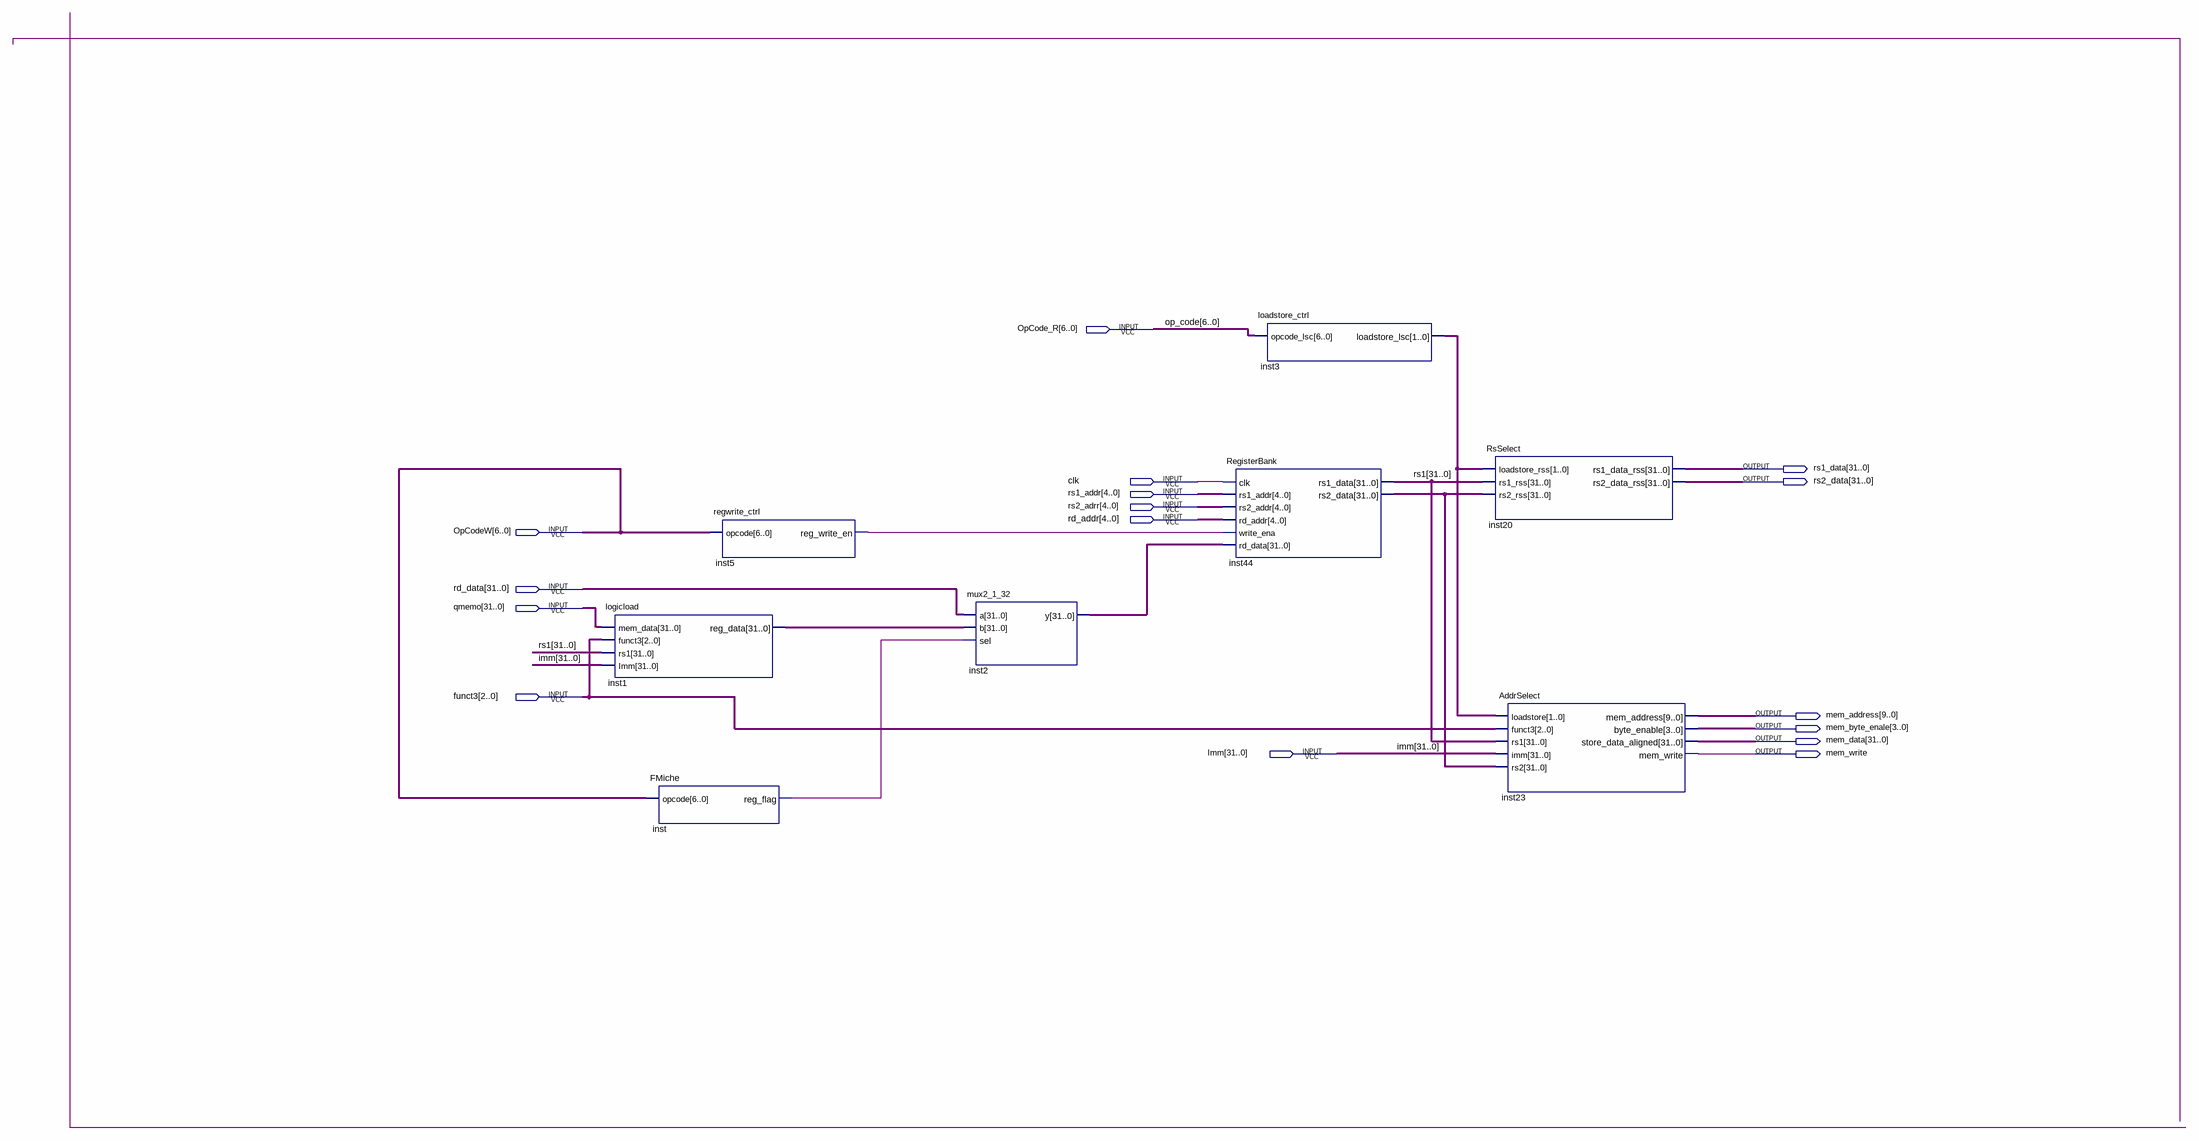
[diagram p0: schematic sheet]
// Quartus schematic Register.bdf as structural Verilog: 8 symbols, 16 pins
module Register (
  input  [6:0] OpCode_R,
  input  clk,
  input  [4:0] rs1_addr,
  input  [4:0] rs2_adrr,
  input  [4:0] rd_addr,
  input  [6:0] OpCodeW,
  input  [31:0] rd_data,
  input  [31:0] qmemo,
  input  [2:0] funct3,
  input  [31:0] Imm,
  output [31:0] rs1_data,
  output [31:0] rs2_data,
  output [9:0] mem_address,
  output [3:0] mem_byte_enale,
  output [31:0] mem_data,
  output mem_write
);

  wire inst5_reg_write_en, inst_reg_flag;
  wire [1:0] inst3_loadstore_lsc;
  wire [31:0] inst1_reg_data, inst2_y, inst44_rs2_data, rs1;

  logicload inst1 (.mem_data(qmemo), .funct3(funct3), .rs1(rs1), .Imm(Imm), .reg_data(inst1_reg_data));
  FMiche inst (.opcode(OpCodeW), .reg_flag(inst_reg_flag));
  regwrite_ctrl inst5 (.opcode(OpCodeW), .reg_write_en(inst5_reg_write_en));
  mux2_1_32 inst2 (.a(rd_data), .b(inst1_reg_data), .sel(inst_reg_flag), .y(inst2_y));
  RegisterBank inst44 (
    .clk(clk), .rs1_addr(rs1_addr), .rs2_addr(rs2_adrr), .rd_addr(rd_addr), .write_ena(inst5_reg_write_en),
    .rd_data(inst2_y), .rs1_data(rs1), .rs2_data(inst44_rs2_data));
  loadstore_ctrl inst3 (.opcode_lsc(OpCode_R), .loadstore_lsc(inst3_loadstore_lsc));
  RsSelect inst20 (
    .loadstore_rss(inst3_loadstore_lsc), .rs1_rss(rs1), .rs2_rss(inst44_rs2_data), .rs1_data_rss(rs1_data),
    .rs2_data_rss(rs2_data));
  AddrSelect inst23 (
    .loadstore(inst3_loadstore_lsc), .funct3(funct3), .rs1(rs1), .imm(Imm), .rs2(inst44_rs2_data),
    .mem_address(mem_address), .byte_enable(mem_byte_enale), .store_data_aligned(mem_data),
    .mem_write(mem_write));

  // Other names for the same wires on the sheet: op_code[6:0] = OpCode_R
endmodule
